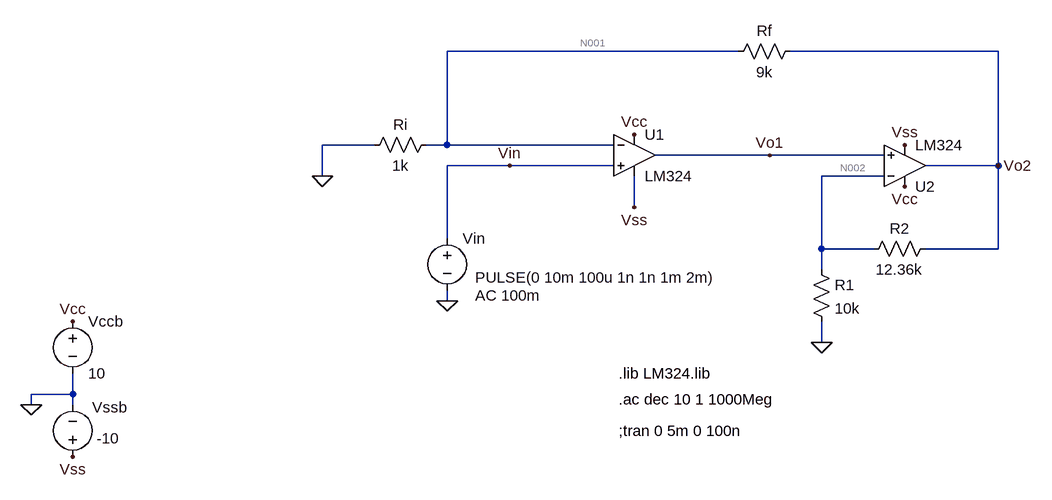
[diagram p0: schematic Lab3_Compensacion(VFA-VFA).asc]
Lab3_Compensacion(VFA-VFA).asc, the LTspice schematic file:
Version 4
SHEET 1 884 712
WIRE 368 -16 -80 -16
WIRE 768 -16 448 -16
WIRE -192 128 -272 128
WIRE -80 128 -80 -16
WIRE -80 128 -112 128
WIRE 176 128 -80 128
WIRE 416 144 240 144
WIRE 592 144 416 144
WIRE 16 160 -80 160
WIRE 176 160 16 160
WIRE 768 160 768 -16
WIRE 768 160 656 160
WIRE -272 176 -272 128
WIRE 592 176 496 176
WIRE 208 224 208 176
WIRE -80 272 -80 160
WIRE 496 288 496 176
WIRE 576 288 496 288
WIRE 768 288 768 160
WIRE 768 288 656 288
WIRE 496 320 496 288
WIRE -80 368 -80 352
WIRE 496 432 496 400
WIRE -656 512 -656 480
WIRE -656 512 -720 512
WIRE -720 528 -720 512
WIRE -656 528 -656 512
FLAG 208 224 Vss
FLAG 208 112 Vcc
FLAG -80 368 0
FLAG -720 528 0
FLAG -656 400 Vcc
FLAG -656 608 Vss
FLAG -272 176 0
FLAG 496 432 0
FLAG 624 192 Vcc
FLAG 624 128 Vss
FLAG 768 160 Vo2
FLAG 416 144 Vo1
FLAG 16 160 Vin
SYMBOL OpAmps\\opamp2 208 80 R0
SYMATTR InstName U1
SYMATTR Value LM324
SYMBOL voltage -80 256 R0
WINDOW 123 43 104 Left 2
WINDOW 39 0 0 Left 0
WINDOW 3 43 76 Left 2
SYMATTR Value2 AC 100m
SYMATTR Value PULSE(0 10m 100u 1n 1n 1m 2m)
SYMATTR InstName Vin
SYMBOL voltage -656 384 R0
WINDOW 123 0 0 Left 0
WINDOW 39 0 0 Left 0
SYMATTR InstName Vccb
SYMATTR Value 10
SYMBOL voltage -656 624 R180
WINDOW 123 0 0 Left 0
WINDOW 39 0 0 Left 0
WINDOW 0 -83 92 Left 2
WINDOW 3 -72 44 Left 2
SYMATTR InstName Vssb
SYMATTR Value -10
SYMBOL OpAmps\\opamp2 624 224 M180
SYMATTR InstName U2
SYMATTR Value LM324
SYMBOL res 480 304 R0
SYMATTR InstName R1
SYMATTR Value 10k
SYMBOL res 672 272 R90
WINDOW 0 0 56 VBottom 2
WINDOW 3 32 56 VTop 2
SYMATTR InstName R2
SYMATTR Value 12.36k
SYMBOL res 464 -32 R90
WINDOW 0 0 56 VBottom 2
WINDOW 3 32 56 VTop 2
SYMATTR InstName Rf
SYMATTR Value 9k
SYMBOL res -96 112 R90
WINDOW 0 0 56 VBottom 2
WINDOW 3 32 56 VTop 2
SYMATTR InstName Ri
SYMATTR Value 1k
TEXT 184 480 Left 2 !.lib LM324.lib
TEXT 184 520 Left 2 !.ac dec 10 1 1000Meg
TEXT 184 568 Left 2 !;tran 0 5m 0 100n

The netlist it stands for:
* Lab3_Compensacion(VFA-VFA).asc
XU1 Vin N001 Vcc Vss Vo1 LM324  ; pins In+ In- V+ V- OUT
Vin Vin 0 PULSE(0 10m 100u 1n 1n 1m 2m) AC 100m
Vccb Vcc 0 10
Vssb Vss 0 -10
XU2 Vo1 N002 Vcc Vss Vo2 LM324  ; pins In+ In- V+ V- OUT
R1 N002 0 10k
R2 Vo2 N002 12.36k
Rf Vo2 N001 9k
Ri N001 0 1k
.lib LM324.lib
.ac dec 10 1 1000Meg
;tran 0 5m 0 100n
.backanno
.end

* Results of the author's LTspice run, read from the files saved beside the schematic
* Operating Point, zero values left out:
*   V(vo1) = -86.9 µV
*   V(vss) = -10 V
*   V(vcc) = 10 V
*   V(n001) = -33.65 µV
*   V(vo2) = -516 µV
*   V(n002) = -120.6 µV
*   I(R1) = -12.06 nA
*   I(R2) = -31.99 nA
*   I(Rf) = -53.59 nA
*   I(Ri) = -33.65 nA
*   I(Vin) = 19.92 nA
*   I(Vccb) = -1.34 mA
*   I(Vssb) = 1.34 mA
*   Ix(u1:1) = -19.92 nA
*   Ix(u1:2) = -19.94 nA
*   Ix(u1:3) = 669.9 µA
*   Ix(u1:4) = -669.8 µA
*   Ix(u1:5) = 19.92 nA
*   Ix(u2:1) = -19.92 nA
*   Ix(u2:2) = -19.94 nA
*   Ix(u2:3) = 669.9 µA
*   Ix(u2:4) = -669.8 µA
*   Ix(u2:5) = 85.59 nA
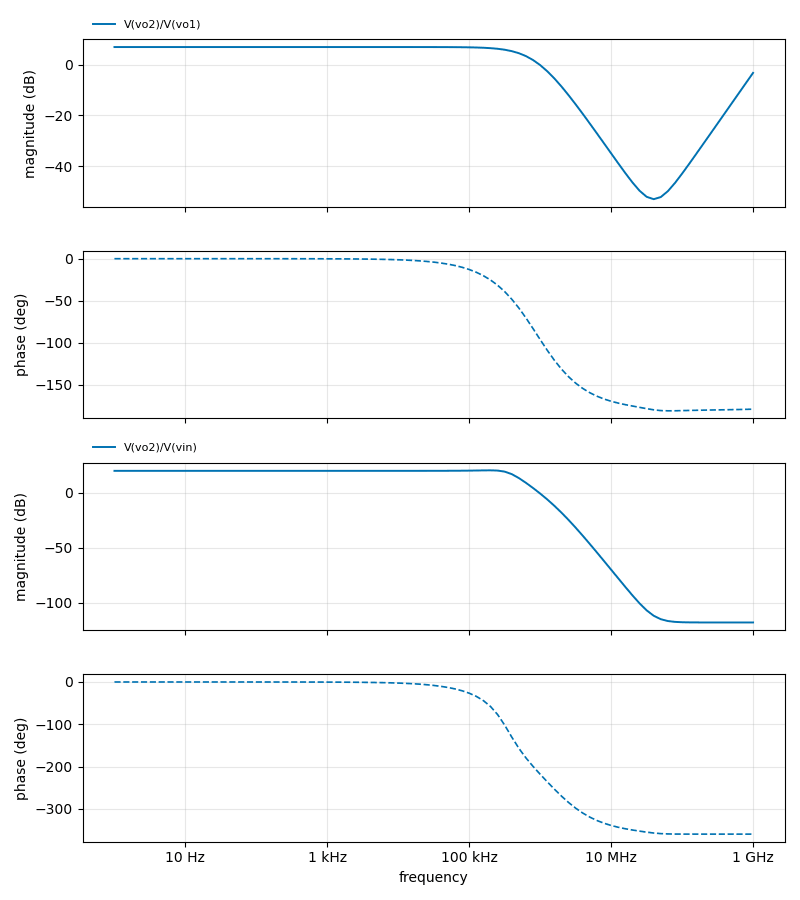
[diagram p1: AC Analysis of Lab3_Compensacion(VFA-VFA).asc, plotted from the saved traces]
* AC Analysis, 1 run:
*   V(vo2)/V(vo1): 6.99 dB at 1 Hz, -3.20 dB at 1 GHz, peak 6.99 dB at 1 Hz, 3 dB below the peak at 562.3 kHz
*   V(vo2)/V(vin): 20.00 dB at 1 Hz, -118.10 dB at 1 GHz, peak 20.45 dB at 199.5 kHz, 3 dB below the peak at 380.1 kHz